# Altium schematic sheet toplevel.SchDoc
size A4
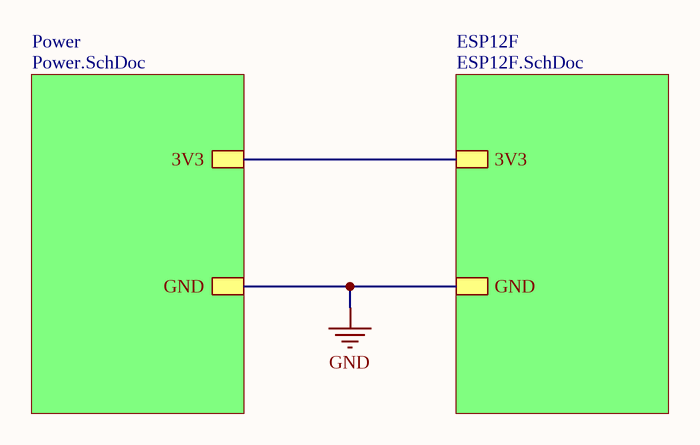
[diagram p0: toplevel.SchDoc]

## Sub-sheets
ESP12F = ESP12F.SchDoc: 3V3, GND
Power = Power.SchDoc: 3V3, GND

## Nets
GND: sheet ESP12F/GND, sheet Power/GND
(unnamed): sheet ESP12F/3V3, sheet Power/3V3